# EAGLE design BonekeyBonekey (EAGLE 6.5.0)
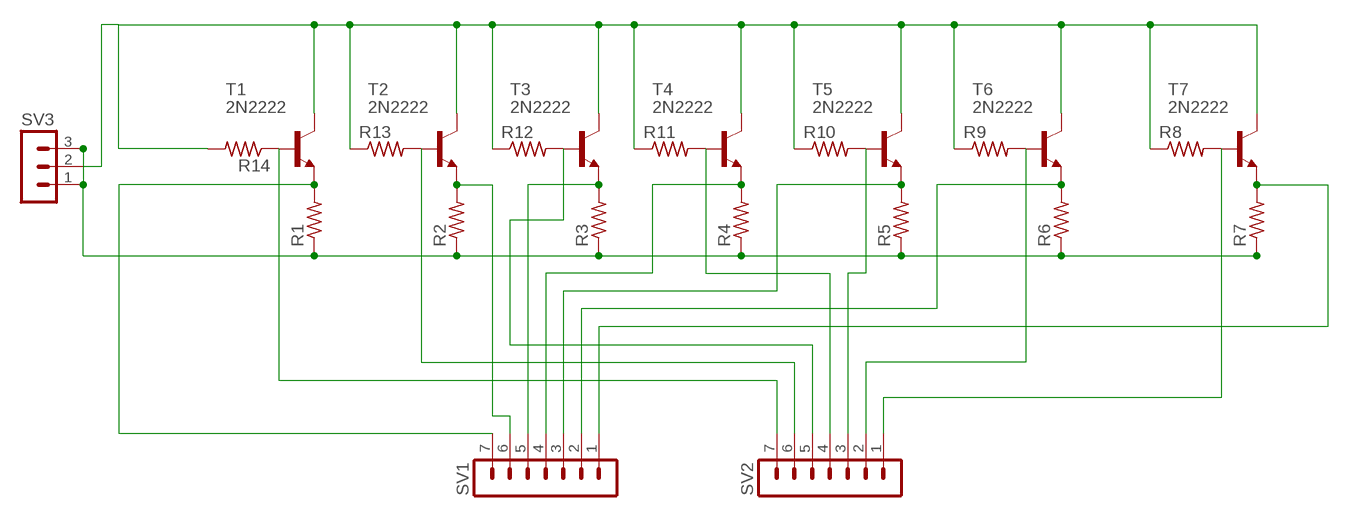
[diagram p0: schematic, sheet 1]

## Parts
R1  R-US_0204/5  [0204/5]
R2  R-US_0204/5  [0204/5]
R3  R-US_0204/5  [0204/5]
R4  R-US_0204/5  [0204/5]
R5  R-US_0204/5  [0204/5]
R6  R-US_0204/5  [0204/5]
R7  R-US_0204/5  [0204/5]
R8  R-US_0204/5  [0204/5]
R9  R-US_0204/5  [0204/5]
R10  R-US_0204/5  [0204/5]
R11  R-US_0204/5  [0204/5]
R12  R-US_0204/5  [0204/5]
R13  R-US_0204/5  [0204/5]
R14  R-US_0204/5  [0204/5]
SV1  MA07-1  [MA07-1]
SV2  MA07-1  [MA07-1]
SV3  MA03-1  [MA03-1]
T1  2N2222  [TO18]
T2  2N2222  [TO18]
T3  2N2222  [TO18]
T4  2N2222  [TO18]
T5  2N2222  [TO18]
T6  2N2222  [TO18]
T7  2N2222  [TO18]

## Nets
N$1: R14.1 SV2.7 T1.2(B)
N$2: R13.2 SV2.6 T2.2(B)
N$3: R12.2 SV2.5 T3.2(B)
N$4: R11.2 SV2.4 T4.2(B)
N$5: R10.2 SV2.3 T5.2(B)
N$6: R9.2 SV2.2 T6.2(B)
N$7: R8.2 SV2.1 T7.2(B)
N$8: R7.2 SV1.1 T7.1(E)
N$9: R6.2 SV1.2 T6.1(E)
N$10: R5.2 SV1.3 T5.1(E)
N$11: R4.2 SV1.4 T4.1(E)
N$12: R3.2 SV1.5 T3.1(E)
N$13: R2.2 SV1.6 T2.1(E)
N$14: R1.2 SV1.7 T1.1(E)
N$15: R8.1 R9.1 R10.1 R11.1 R12.1 R13.1 R14.2 SV3.2 T1.3(C) T2.3(C) T3.3(C) T4.3(C) T5.3(C) T6.3(C) T7.3(C)
N$16: R1.1 R2.1 R3.1 R4.1 R5.1 R6.1 R7.1 SV3.1 SV3.3

## Library data of the parts
R1-R14 = resistor:R-US_: RESISTOR, American symbol
SV1 SV2 = con-lstb:MA07-1: PIN HEADER; OC_FARNELL: unknown; OC_NEWARK: unknown
SV3 = con-lstb:MA03-1: PIN HEADER; OC_FARNELL: unknown; OC_NEWARK: unknown
T1-T7 = transistor:2N2222: NPN TRANSISTOR

## Net classes
0 default: clearance 0.205 mm

## Board
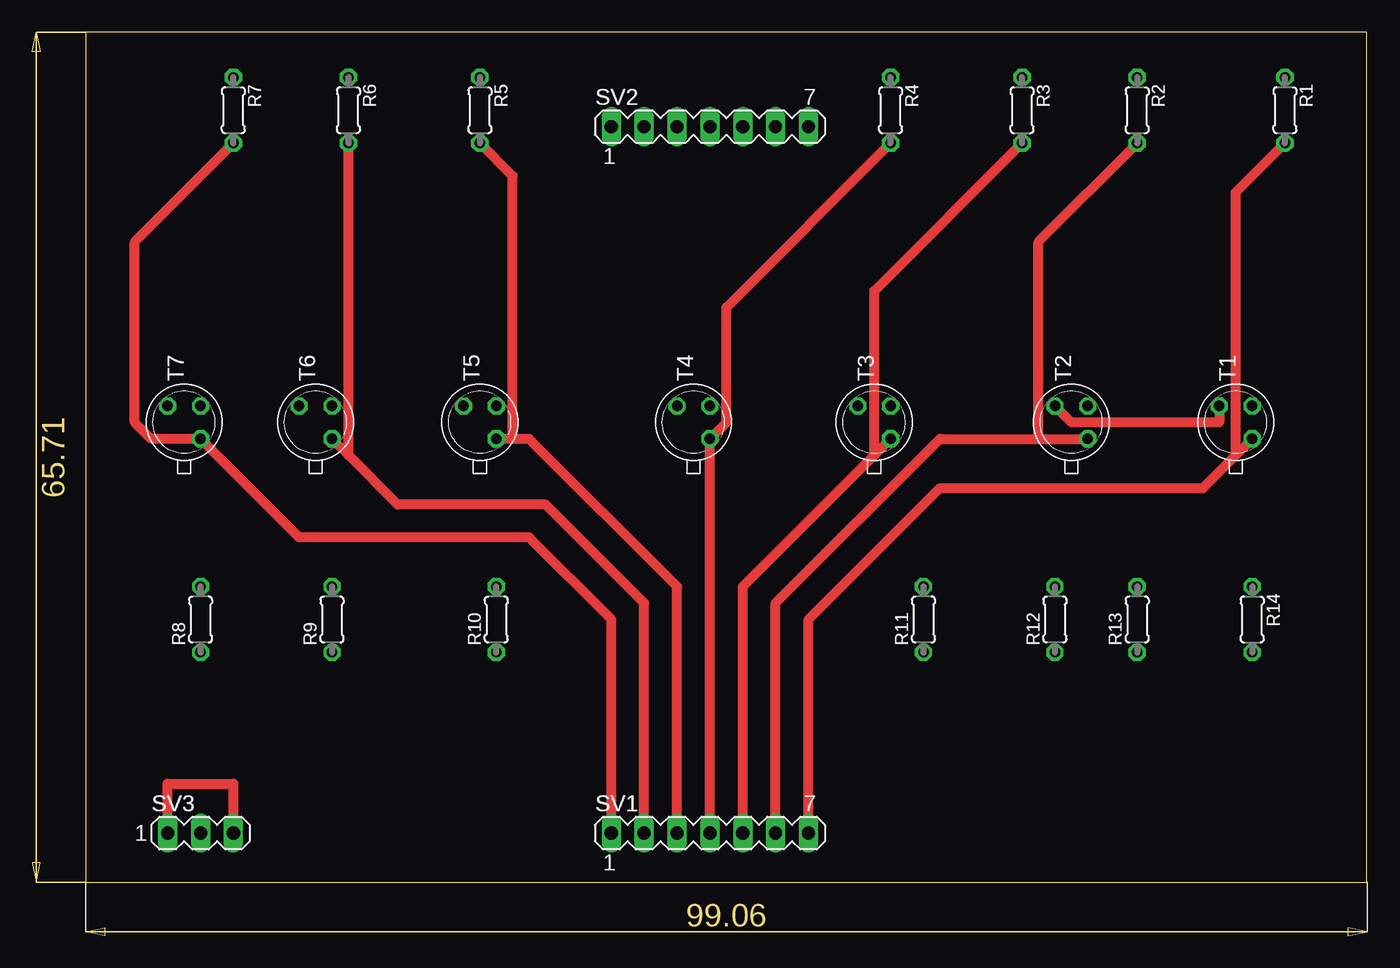
[diagram p1: board, top side]
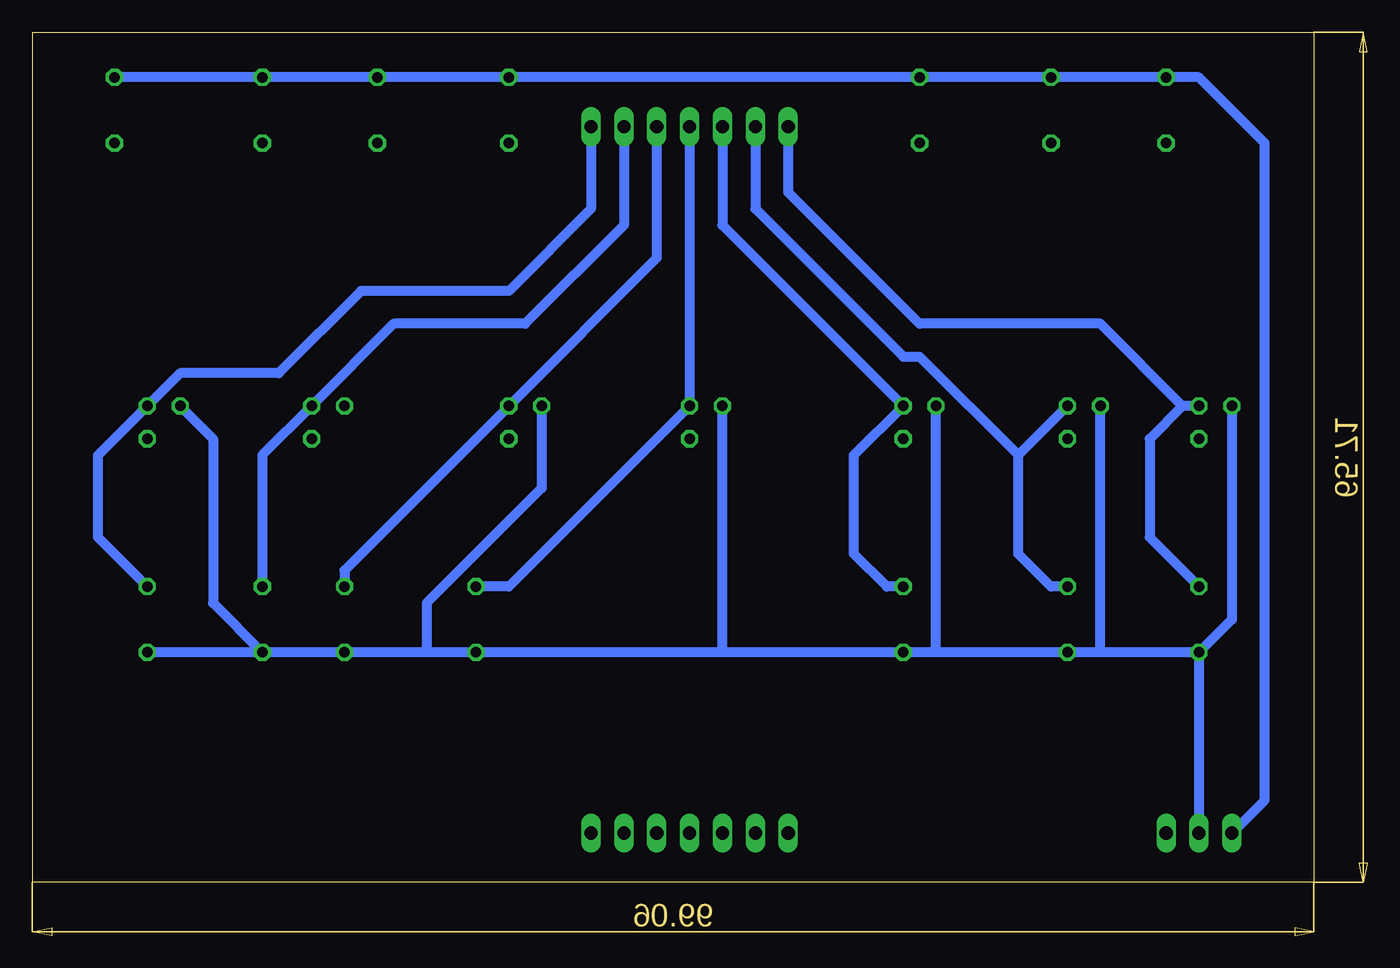
[diagram p2: board, bottom side, seen from below]

Size 99.04 x 65.71 mm. Coordinates in mm from the lower left corner, seen from the top.
Outline: 0,0 99.04,0 99.04,65.71 0,65.71 0,0
Copper layers (1*16): Top 0.035mm / dielectric 1.5mm / Bottom 0.035mm
Design rules "default *": minimum track width 30mil, minimum drill 30mil, track to track 8mil, track to pad 8mil, pad to pad 8mil, via to via 8mil, smd to smd 8mil, copper to edge 40mil, drill to drill 8mil, minimum pad ring 10mil, minimum via ring 8mil, stop-mask expansion 4mil, vias tented up to drill 0mil, thermal gap 10mil

### Footprints (pad centres in the part's own frame; a part is rotated, then mirrored left to right if it is on the bottom)
0204/5 = drill 0.813 octagon: 1 -2.54,0; 2 2.54,0
MA07-1 = drill 1.016 long: 1 -7.62,0; 2 -5.08,0; 3 -2.54,0; 4 0,0; 5 2.54,0; 6 5.08,0; 7 7.62,0
MA03-1 = drill 1.016 long: 1 -2.54,0; 2 0,0; 3 2.54,0
TO18 = drill 0.813 octagon: 1 -1.27,-1.27; 2 1.27,-1.27; 3 1.27,1.27

### Placement (x,y rotation side)
R1  92.71,59.69 270 top
R2  81.28,59.69 270 top
R3  72.39,59.69 270 top
R4  62.23,59.69 270 top
R5  30.48,59.69 270 top
R6  20.32,59.69 270 top
R7  11.43,59.69 270 top
R8  8.89,20.32 90 top
R9  19.05,20.32 90 top
R10  31.75,20.32 90 top
R11  64.77,20.32 90 top
R12  74.93,20.32 90 top
R13  81.28,20.32 90 top
R14  90.17,20.32 270 top
SV1  48.26,3.81 0 top
SV2  48.26,58.42 0 top
SV3  8.89,3.81 0 top
T1  88.9,35.56 90 top
T2  76.2,35.56 90 top
T3  60.96,35.56 90 top
T4  46.99,35.56 90 top
T5  30.48,35.56 90 top
T6  17.78,35.56 90 top
T7  7.62,35.56 90 top

### Tracks (layer width: path | path; a pad name or v marks a point on that pad's centre or on a via)
N$1
  Bottom 0.762: R14.1 93.98,26.67 93.98,33.02 T1.2 87.63,39.37 80.01,39.37 73.66,45.72 62.23,45.72 55.88,52.07 SV2.7
N$2
  Bottom 0.762: SV2.6 53.34,50.8 60.96,43.18 71.12,43.18 T2.2 81.28,33.02 R13.2
N$3
  Bottom 0.762: SV2.5 50.8,48.26 T3.2 74.93,24.13 R12.2
N$4
  Bottom 0.762: SV2.4 T4.2 62.23,22.86 R11.2
N$5
  Bottom 0.762: R10.2 33.02,22.86 35.56,25.4 35.56,33.02 T5.2 45.72,50.8 SV2.3
N$6
  Bottom 0.762: R9.2 20.32,22.86 22.86,25.4 22.86,33.02 | 22.86,33.02 T6.2 | SV2.2 43.18,52.07 31.75,40.64 30.48,40.64 22.86,33.02
N$7
  Bottom 0.762: T7.2 10.16,36.83 | 10.16,36.83 12.7,34.29 12.7,26.67 R8.2 | SV2.1 40.64,53.34 30.48,43.18 16.51,43.18 10.16,36.83
N$8
  Top 0.762: SV1.1 40.64,20.32 34.29,26.67 16.51,26.67 T7.1 5.08,34.29 3.81,35.56 3.81,49.53 R7.2
N$9
  Top 0.762: SV1.2 43.18,21.59 35.56,29.21 24.13,29.21 20.32,33.02 | 20.32,33.02 T6.1 | 20.32,33.02 R6.2
N$10
  Top 0.762: SV1.3 45.72,22.86 34.29,34.29 33.02,34.29 | 33.02,34.29 T5.1 | R5.2 33.02,54.61 33.02,34.29
N$11
  Top 0.762: SV1.4 T4.1 49.53,35.56 49.53,44.45 R4.2
N$12
  Top 0.762: SV1.5 50.8,22.86 60.96,33.02 | 60.96,33.02 T3.1 | R3.2 60.96,45.72 60.96,33.02
N$13
  Top 0.762: SV1.6 53.34,21.59 66.04,34.29 73.66,34.29 | 73.66,34.29 T2.1 | R2.2 73.66,49.53 73.66,34.29
N$14
  Top 0.762: SV1.7 55.88,20.32 66.04,30.48 86.36,30.48 88.9,33.02 | 88.9,33.02 T1.1 | R1.2 88.9,53.34 88.9,33.02
N$15
  Top 0.762: T2.3 76.2,35.56 87.63,35.56 T1.3
  Bottom 0.762: R8.1 16.51,17.78 | 16.51,17.78 R9.1 29.21,17.78 | 29.21,17.78 R10.1 45.72,17.78 | 45.72,17.78 R11.1 68.58,17.78 | 68.58,17.78 R12.1 R13.1 | R13.1 R14.2 | R8.1 SV3.2 | T1.3 85.09,34.29 85.09,21.59 R13.1 | 16.51,17.78 T6.3 | 29.21,17.78 T5.3 | 45.72,17.78 T4.3 | T7.3 6.35,20.32 R8.1 | T3.3 59.69,30.48 68.58,21.59 68.58,17.78
N$16
  Top 0.762: SV3.1 6.35,7.62 11.43,7.62 SV3.3
  Bottom 0.762: SV3.1 3.81,6.35 3.81,57.15 8.89,62.23 R7.1 R6.1 R5.1 R4.1 R3.1 R2.1 R1.1

### Text on the board
_tNames: R7 | R6 | R5 | R4 | R3 | R2 | R1 | SV2 | T7 | T6 | T5 | T4 | T3 | T2 | T1 | R14 | R8 | R9 | R10 | R11 | R12 | R13 | SV3 | SV1